# Altium schematic sheet Snickerdoodle.SchDoc: Snickerdoodle Top
size Tabloid; ApprovedBy: NA; CompanyName: Cospan Design LLC; DrawnBy: Dave McCoy; Engineer: Dave McCoy; DocumentNumber: 2; Revision: A; SheetNumber: 2; SheetTotal: 20; Client: Public; Project: Enigma; ProjectPrettyName: Enigma
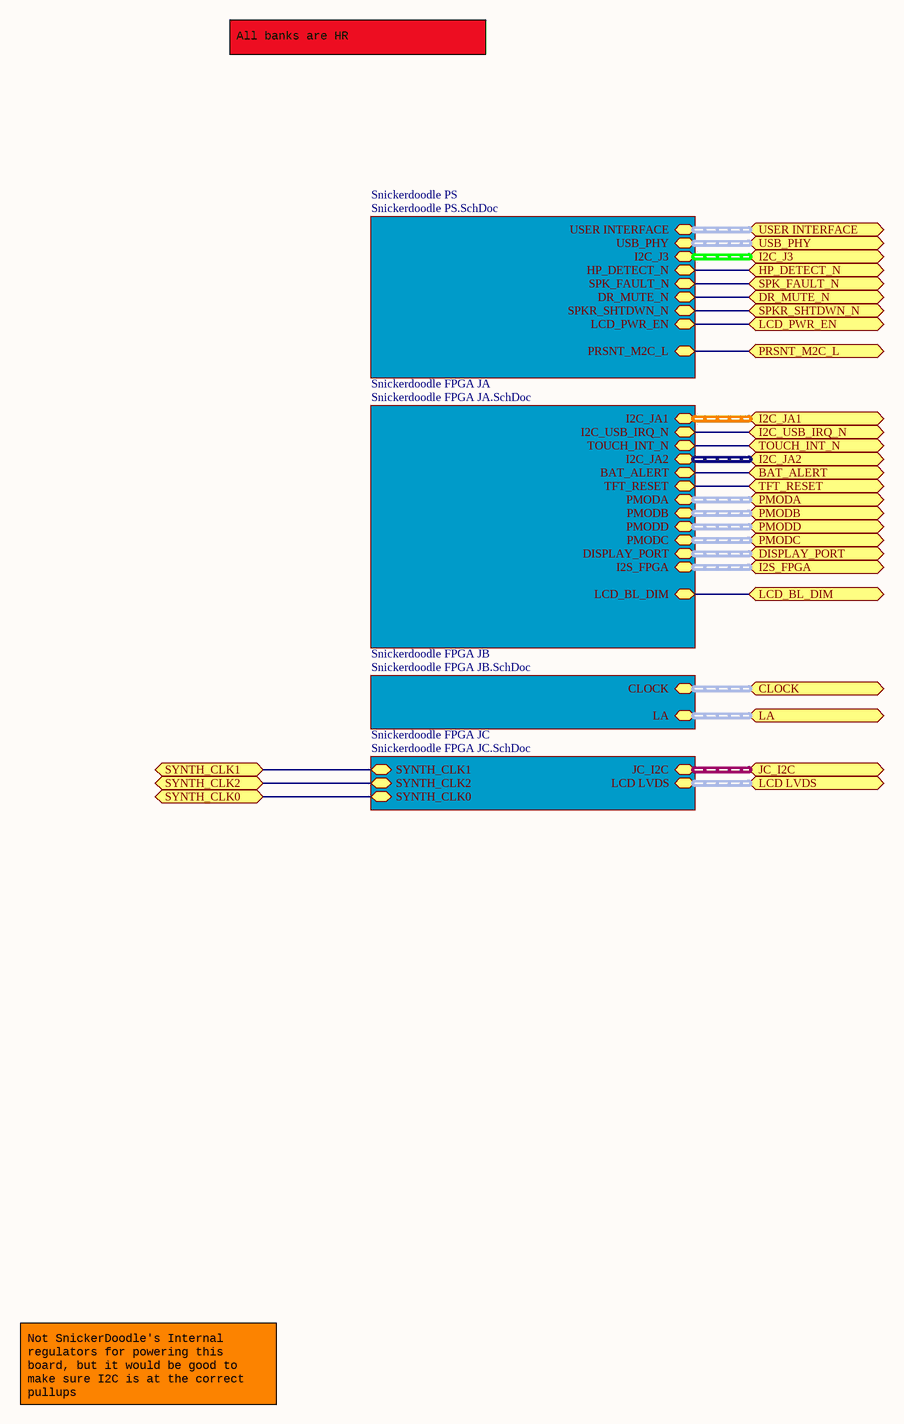
[diagram p0: Snickerdoodle.SchDoc]

## Sub-sheets
Snickerdoodle FPGA JA = Snickerdoodle FPGA JA.SchDoc: I2C_USB_IRQ_N, BAT_ALERT, PMODA (harness PMOD_Harness), PMODB (harness PMOD_Harness), PMODD (harness PMOD_Harness), PMODC (harness PMOD_Harness), DISPLAY_PORT (harness Display Port), I2S_FPGA (harness I2S Harness), TFT_RESET, TOUCH_INT_N, LCD_BL_DIM, I2C_JA2 (harness I2C Harness), I2C_JA1 (harness I2C Harness)
Snickerdoodle FPGA JB = Snickerdoodle FPGA JB.SchDoc: CLOCK (harness FMC_J1_CLOCK), LA (harness FMC_J1_LA)
Snickerdoodle FPGA JC = Snickerdoodle FPGA JC.SchDoc: JC_I2C (harness I2C Harness), SYNTH_CLK1, SYNTH_CLK2, SYNTH_CLK0, LCD LVDS (harness LCD Harness)
Snickerdoodle PS = Snickerdoodle PS.SchDoc: USER INTERFACE (harness User Interface Harness), USB_PHY (harness USB Phy Harness), I2C_J3 (harness I2C Harness), HP_DETECT_N, SPK_FAULT_N, DR_MUTE_N, SPKR_SHTDWN_N, LCD_PWR_EN, PRSNT_M2C_L

## Ports
BAT_ALERT, CLOCK (harness FMC_J1_CLOCK), DISPLAY_PORT (harness Display Port), DR_MUTE_N, HP_DETECT_N, I2C_J3 (harness I2C Harness), I2C_JA1 (harness I2C Harness), I2C_JA2 (harness I2C Harness), I2C_USB_IRQ_N, I2S_FPGA (harness I2S Harness), JC_I2C (harness I2C Harness), LA (harness FMC_J1_LA), LCD LVDS (harness LCD Harness), LCD_BL_DIM, LCD_PWR_EN, PMODA (harness PMOD_Harness), PMODB (harness PMOD_Harness), PMODC (harness PMOD_Harness), PMODD (harness PMOD_Harness), PRSNT_M2C_L, SPK_FAULT_N, SPKR_SHTDWN_N, SYNTH_CLK0, SYNTH_CLK1, SYNTH_CLK2, TFT_RESET, TOUCH_INT_N, USB_PHY (harness USB Phy Harness), USER INTERFACE (harness User Interface Harness)

## Nets
BAT_ALERT: port BAT_ALERT, sheet Snickerdoodle FPGA JA/BAT_ALERT
DR_MUTE_N: port DR_MUTE_N, sheet Snickerdoodle PS/DR_MUTE_N
HP_DETECT_N: port HP_DETECT_N, sheet Snickerdoodle PS/HP_DETECT_N
I2C_USB_IRQ_N: port I2C_USB_IRQ_N, sheet Snickerdoodle FPGA JA/I2C_USB_IRQ_N
LCD_BL_DIM: port LCD_BL_DIM, sheet Snickerdoodle FPGA JA/LCD_BL_DIM
LCD_PWR_EN: port LCD_PWR_EN, sheet Snickerdoodle PS/LCD_PWR_EN
PRSNT_M2C_L: port PRSNT_M2C_L, sheet Snickerdoodle PS/PRSNT_M2C_L
SPK_FAULT_N: port SPK_FAULT_N, sheet Snickerdoodle PS/SPK_FAULT_N
SPKR_SHTDWN_N: port SPKR_SHTDWN_N, sheet Snickerdoodle PS/SPKR_SHTDWN_N
SYNTH_CLK0: port SYNTH_CLK0, sheet Snickerdoodle FPGA JC/SYNTH_CLK0
SYNTH_CLK1: port SYNTH_CLK1, sheet Snickerdoodle FPGA JC/SYNTH_CLK1
SYNTH_CLK2: port SYNTH_CLK2, sheet Snickerdoodle FPGA JC/SYNTH_CLK2
TFT_RESET: port TFT_RESET, sheet Snickerdoodle FPGA JA/TFT_RESET
TOUCH_INT_N: port TOUCH_INT_N, sheet Snickerdoodle FPGA JA/TOUCH_INT_N

## Buses and harness runs
harness port CLOCK = sheet Snickerdoodle FPGA JB/CLOCK
harness port DISPLAY_PORT = sheet Snickerdoodle FPGA JA/DISPLAY_PORT
harness port I2C_J3 = sheet Snickerdoodle PS/I2C_J3
harness port I2C_JA1 = sheet Snickerdoodle FPGA JA/I2C_JA1
harness port I2C_JA2 = sheet Snickerdoodle FPGA JA/I2C_JA2
harness port I2S_FPGA = sheet Snickerdoodle FPGA JA/I2S_FPGA
harness port JC_I2C = sheet Snickerdoodle FPGA JC/JC_I2C
harness port LA = sheet Snickerdoodle FPGA JB/LA
harness port LCD LVDS = sheet Snickerdoodle FPGA JC/LCD LVDS
harness port PMODA = sheet Snickerdoodle FPGA JA/PMODA
harness port PMODB = sheet Snickerdoodle FPGA JA/PMODB
harness port PMODC = sheet Snickerdoodle FPGA JA/PMODC
harness port PMODD = sheet Snickerdoodle FPGA JA/PMODD
harness port USB_PHY = sheet Snickerdoodle PS/USB_PHY
harness port USER INTERFACE = sheet Snickerdoodle PS/USER INTERFACE

## Notes on the sheet
- All banks are HR
- Not SnickerDoodle's Internal regulators for powering this board, but it would be good to make sure I2C is at the correct pullups
- Project:
- http://www.cospandesign.com
- Cospan Design
- Document:
- Engineer:
- Title:
- Client:
- Approved By:
- Revision:
- Date:
- Number:
- of